# EAGLE design i2s-shifter (EAGLE 6.4)
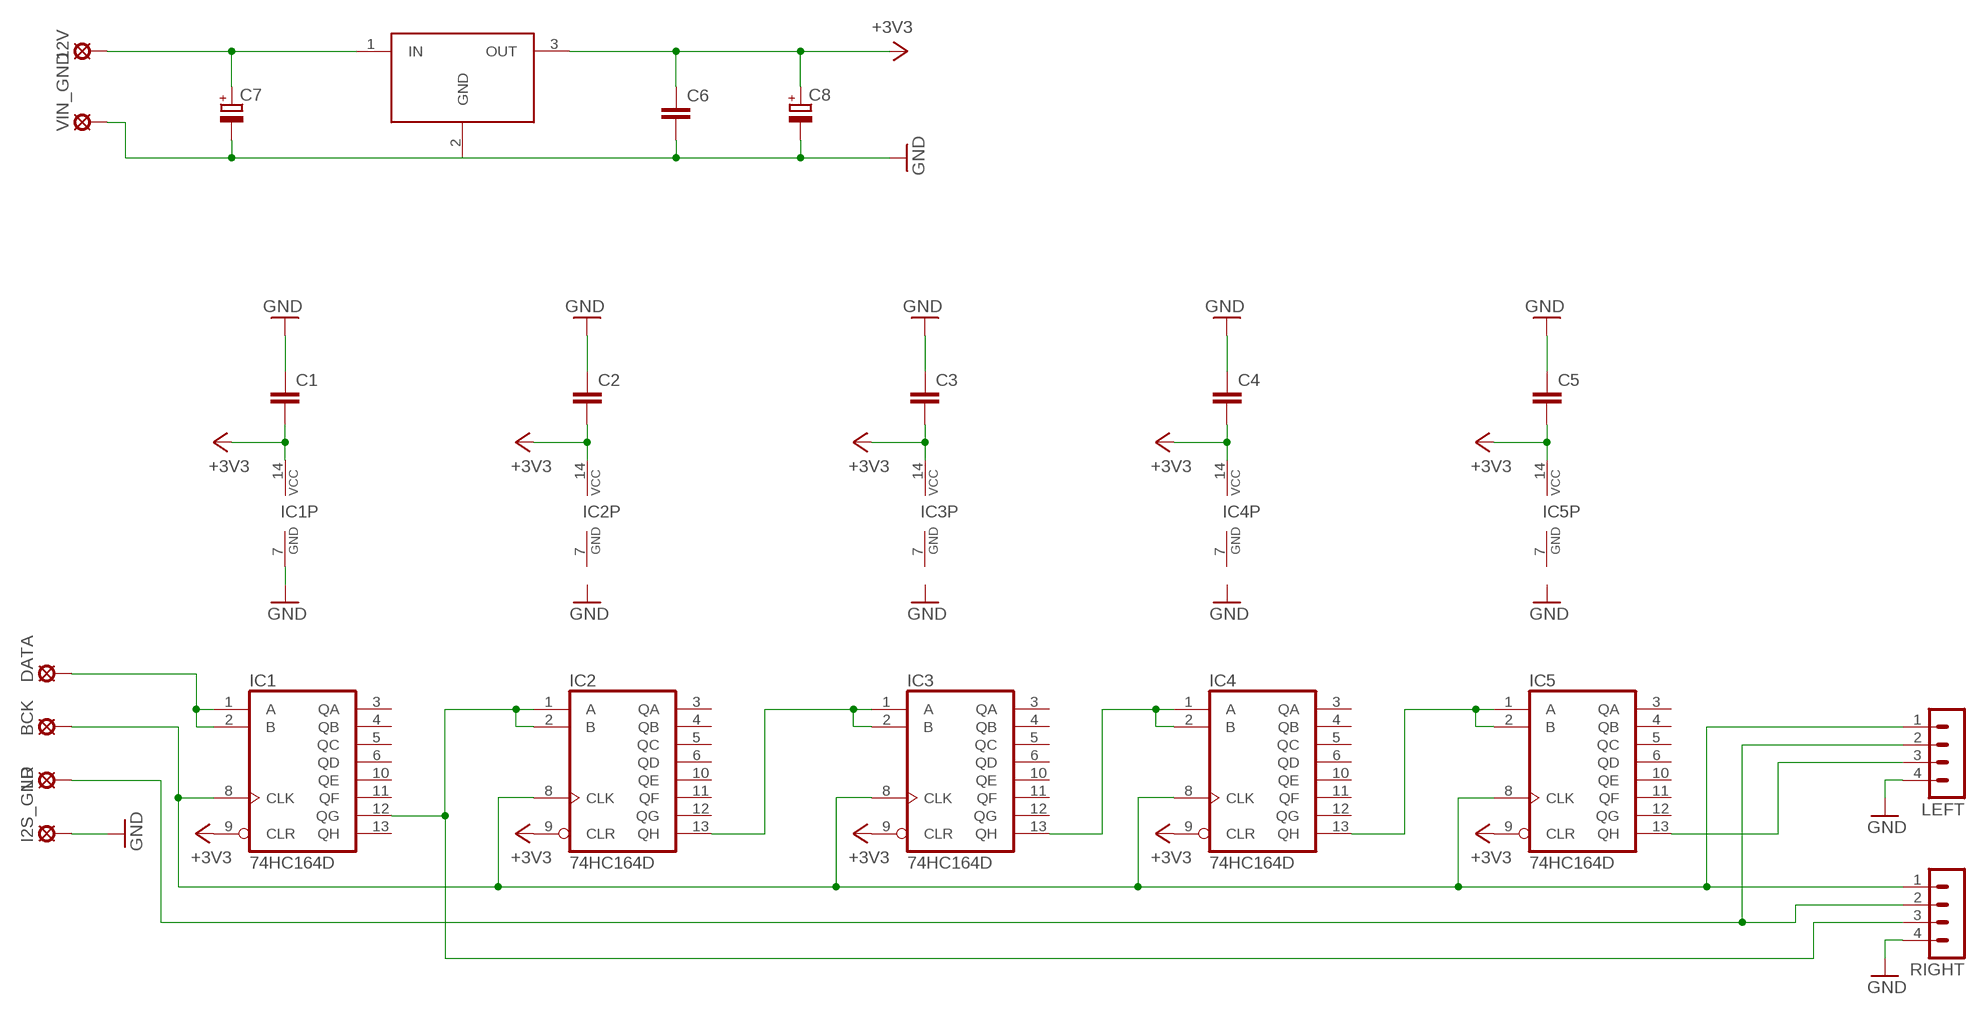
[diagram p0: schematic, sheet 1]

## Parts
12V  LSP10  [LSP10]
BCK  LSP10  [LSP10]
C1  C-EU050-025X075  [C050-025X075]
C2  C-EU050-025X075  [C050-025X075]
C3  C-EU050-025X075  [C050-025X075]
C4  C-EU050-025X075  [C050-025X075]
C5  C-EU050-025X075  [C050-025X075]
C6  C-EU050-025X075  [C050-025X075]
C7  CPOL-EUE7.5-16  [E7,5-16]
C8  CPOL-EUE5-10.5  [E5-10,5]
DATA  LSP10  [LSP10]
I2S_GND  LSP10  [LSP10]
IC1  74HC164D  [SO14]
IC2  74HC164D  [SO14]
IC3  74HC164D  [SO14]
IC4  74HC164D  [SO14]
IC5  74HC164D  [SO14]
IT1  LM3940IT-3.3  [TO220V]
LEFT  MA04-1  [MA04-1]
LR  LSP10  [LSP10]
RIGHT  MA04-1  [MA04-1]
VIN_GND  LSP10  [LSP10]

## Nets
+3V3: C1.2 C2.2 C3.2 C4.2 C5.2 C6.1 C8.+ IC1.9(CLR) IC1.14(VCC) IC2.9(CLR) IC2.14(VCC) IC3.9(CLR) IC3.14(VCC) IC4.9(CLR) IC4.14(VCC) IC5.9(CLR) IC5.14(VCC) IT1.3(OUT)
N$1: DATA.MP IC1.1(A) IC1.2(B)
N$2: BCK.MP IC1.8(CLK) IC2.8(CLK) IC3.8(CLK) IC4.8(CLK) IC5.8(CLK) LEFT.1 RIGHT.1
N$3: IC1.12(QG) IC2.1(A) IC2.2(B) RIGHT.3
N$4: IC2.13(QH) IC3.1(A) IC3.2(B)
N$5: IC3.13(QH) IC4.1(A) IC4.2(B)
N$6: IC4.13(QH) IC5.1(A) IC5.2(B)
N$7: LEFT.2 LR.MP RIGHT.2
N$8: IC5.13(QH) LEFT.3
N$10: 12V.MP C7.+ IT1.1(IN)
NS999: C1.1 C2.1 C3.1 C4.1 C5.1 C6.2 C7.- C8.- I2S_GND.MP IC1.7(GND) LEFT.4 RIGHT.4 VIN_GND.MP ; supply symbol labelled GND
Unconnected: IC1.3(QA) IC1.4(QB) IC1.5(QC) IC1.6(QD) IC1.10(QE) IC1.11(QF) IC1.13(QH) IC2.3(QA) IC2.4(QB) IC2.5(QC) IC2.6(QD) IC2.10(QE) IC2.11(QF) IC2.12(QG) IC3.3(QA) IC3.4(QB) IC3.5(QC) IC3.6(QD) IC3.10(QE) IC3.11(QF) IC3.12(QG) IC4.3(QA) IC4.4(QB) IC4.5(QC) IC4.6(QD) IC4.10(QE) IC4.11(QF) IC4.12(QG) IC5.3(QA) IC5.4(QB) IC5.5(QC) IC5.6(QD) IC5.10(QE) IC5.11(QF) IC5.12(QG)

## Power pins joined to a net without a drawn wire
NS999: IC2.7(GND) IC3.7(GND) IC4.7(GND) IC5.7(GND) IT1.2(GND)

## Library data of the parts
12V BCK DATA I2S_GND LR VIN_GND = solpad:LSP10: SOLDER PAD drill 1.0 mm, distributor Buerklin, 12H555
C1-C6 = resistor:C-EU: CAPACITOR, European symbol
C7 C8 = resistor:CPOL-EU: POLARIZED CAPACITOR, European symbol
IC1-IC5 = 74xx-eu:74*164: 8-bit parallel out SHIFT REGISTER
IT1 = LM3940:LM3940IT-3.3: 1A Low Dropout Regulator for 5V to 3.3V Conversion
LEFT RIGHT = con-lstb:MA04-1: PIN HEADER; OC_FARNELL: unknown; OC_NEWARK: unknown

## Board
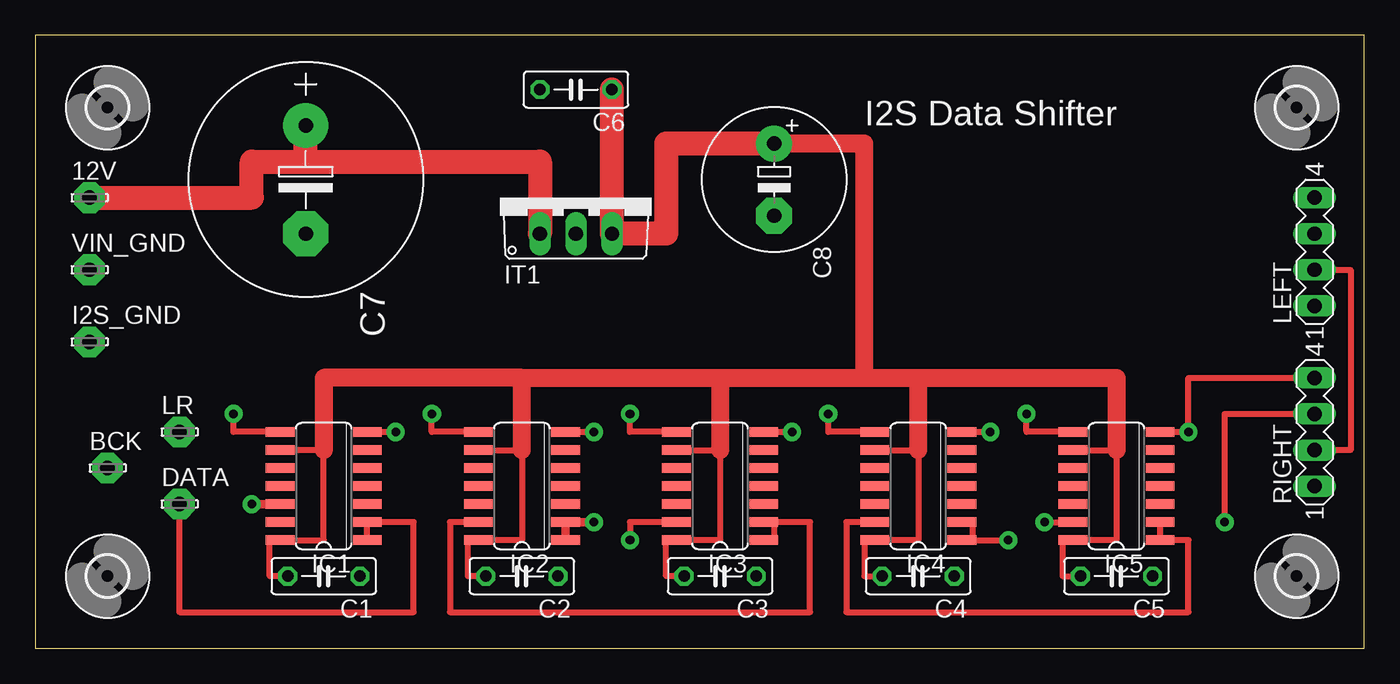
[diagram p1: board, top side]
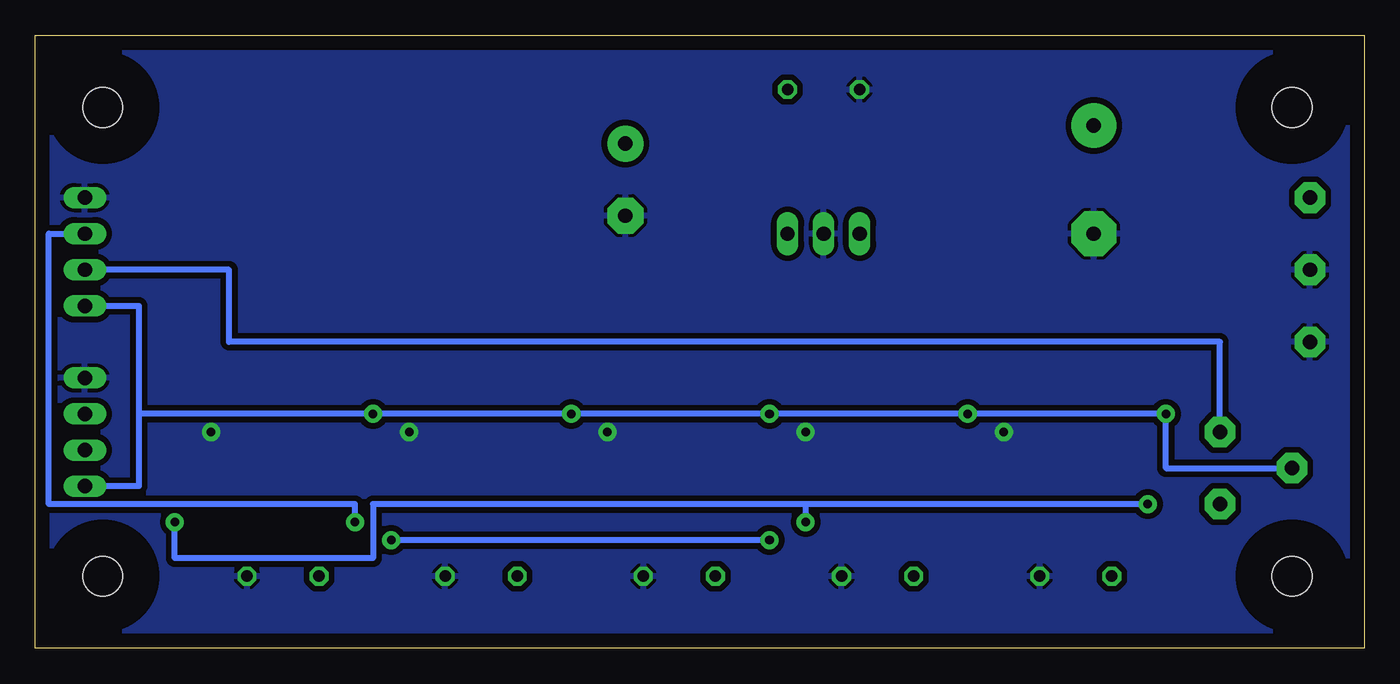
[diagram p2: board, bottom side, seen from below]

Size 93.65 x 43.18 mm. Coordinates in mm from the lower left corner, seen from the top.
Outline: 0,0 93.65,0 93.65,43.18 0,43.18 0,0
Copper layers (1*16): Top 0.035mm / dielectric 1.5mm / Bottom 0.035mm
Design rules "default": minimum track width 10mil, minimum drill 24mil, track to track 8mil, track to pad 8mil, pad to pad 8mil, via to via 8mil, smd to smd 8mil, copper to edge 40mil, drill to drill 8mil, minimum pad ring 10mil, minimum via ring 8mil, stop-mask expansion 4mil, vias tented up to drill 0mil, thermal gap 10mil

### Footprints (pad centres in the part's own frame; a part is rotated, then mirrored left to right if it is on the bottom)
LSP10 = drill 1.016 pad 2.159 octagon: MP 0,0
C050-025X075 = drill 0.813 octagon: 1 -2.54,0; 2 2.54,0
E7,5-16 = drill 1.016 pad 3.15: + -3.81,0 | drill 1.016 pad 3.15 octagon: - 3.81,0
E5-10,5 = drill 1.016 pad 2.54: + -2.54,0 | drill 1.016 pad 2.54 octagon: - 2.54,0
SO14 = smd 0.66 x 2.032: 1 -3.81,-3.073; 2 -2.54,-3.073; 3 -1.27,-3.073; 4 0,-3.073; 5 1.27,-3.073; 6 2.54,-3.073; 7 3.81,-3.073; 8 3.81,3.073; 9 2.54,3.073; 10 1.27,3.073; 11 0,3.073; 12 -1.27,3.073; 13 -2.54,3.073; 14 -3.81,3.073
TO220V = drill 1.016 long: 1 -2.54,-2.54; 2 0,-2.54; 3 2.54,-2.54
MA04-1 = drill 1.016 long: 1 -3.81,0; 2 -1.27,0; 3 1.27,0; 4 3.81,0
2,8 = hole 2.8: 0,0

### Placement (x,y rotation side)
12V  3.81,31.75 0 top
BCK  5.08,12.7 0 top
C1  20.32,5.08 180 top
C2  34.29,5.08 180 top
C3  48.26,5.08 180 top
C4  62.23,5.08 180 top
C5  76.2,5.08 180 top
C6  38.1,39.37 180 top
C7  19.05,33.02 270 top
C8  52.07,33.02 270 top
DATA  10.16,10.16 0 top
I2S_GND  3.81,21.59 0 top
IC1  20.32,11.43 90 top
IC2  34.29,11.43 90 top
IC3  48.26,11.43 90 top
IC4  62.23,11.43 90 top
IC5  76.2,11.43 90 top
IT1  38.1,31.75 0 top
LEFT  90.17,27.94 90 top
LR  10.16,15.24 0 top
RIGHT  90.17,15.24 90 top
U$1  [2,8]  88.9,38.1 0 top
U$2  [2,8]  5.08,38.1 0 top
U$3  [2,8]  5.08,38.1 0 top
U$4  [2,8]  5.08,5.08 0 top
U$5  [2,8]  88.9,38.1 0 top
U$6  [2,8]  88.9,5.08 0 top
VIN_GND  3.81,26.67 0 top

### Tracks (layer width: path | path; a pad name or v marks a point on that pad's centre or on a via)
+3V3
  Top 0.406: IC2.9 34.29,13.97 34.29,7.62 IC2.14 30.48,7.62 30.48,5.08 C2.2 | IC3.9 48.26,13.97 48.26,7.62 IC3.14 44.45,7.62 44.45,5.08 C3.2 | IC4.9 62.23,13.97 62.23,7.62 IC4.14 58.42,7.62 58.42,5.08 C4.2 | IC5.9 76.2,13.97 76.2,7.62 IC5.14 72.39,7.62 72.39,5.08 C5.2 | C1.2 16.51,5.08 16.51,7.62 IC1.14 20.32,7.62 20.32,13.97 IC1.9
  Top 1.27: 58.42,19.05 62.23,19.05 | 48.26,19.05 58.42,19.05 | 58.42,19.05 58.42,35.56 C8.+ | 34.29,19.05 20.32,19.05 20.32,13.97 | 34.29,13.97 34.29,19.05 | 34.29,19.05 48.26,19.05 | 48.26,19.05 48.26,13.97 | 62.23,13.97 62.23,19.05 | 62.23,19.05 76.2,19.05 76.2,13.97
  Top 1.676: C6.1 IT1.3 44.45,29.21 44.45,35.56 C8.+
N$1
  Top 0.406: IC1.1 IC1.2 26.67,8.89 26.67,2.54 10.16,2.54 DATA.MP
N$2  (via drill 0.6 pad 1.27)
  Top 0.406: 17.78,15.24 IC1.8 13.97,15.24 v13.97,16.51 | IC2.8 27.94,15.24 v27.94,16.51 | IC3.8 41.91,15.24 v41.91,16.51 | IC4.8 55.88,15.24 v55.88,16.51 | IC5.8 69.85,15.24 v69.85,16.51
  Bottom 0.406: RIGHT.1 86.36,11.43 86.36,16.51 | LEFT.1 86.36,24.13 86.36,16.51 | BCK.MP 13.97,12.7 v13.97,16.51 v27.94,16.51 v41.91,16.51 v55.88,16.51 v69.85,16.51 86.36,16.51
N$3  (via drill 0.6 pad 1.27)
  Top 0.406: IC2.1 36.83,7.62 | v83.82,8.89 83.82,16.51 RIGHT.3
  Top 0.61: IC1.12 v15.24,10.16 | v39.37,8.89 IC2.2 IC2.1
  Bottom 0.406: v15.24,10.16 39.37,10.16 | 39.37,10.16 v39.37,8.89 | 39.37,10.16 69.85,10.16 69.85,6.35 83.82,6.35 v83.82,8.89
N$4
  Top 0.406: IC2.13 29.21,8.89 29.21,2.54 54.61,2.54 54.61,8.89 52.07,8.89 | IC3.1 52.07,7.62 52.07,8.89 | IC3.2 52.07,8.89
N$5  (via drill 0.6 pad 1.27)
  Top 0.406: IC3.13 41.91,8.89 v41.91,7.62 | IC4.2 66.04,8.89 66.04,7.62 v68.58,7.62 IC4.1
  Bottom 0.406: v41.91,7.62 v68.58,7.62
N$6
  Top 0.406: IC4.13 57.15,8.89 57.15,2.54 81.28,2.54 81.28,7.62 IC5.1 IC5.2
N$7
  Top 0.406: LEFT.2 92.71,26.67 92.71,13.97 RIGHT.2
  Bottom 0.406: LR.MP 10.16,21.59 80.01,21.59 80.01,26.67 LEFT.2
N$8  (via drill 0.6 pad 1.27)
  Top 0.406: v71.12,8.89 IC5.13
  Bottom 0.406: LEFT.3 92.71,29.21 92.71,10.16 71.12,10.16 v71.12,8.89
N$10
  Top 1.676: 19.05,34.29 C7.+ | 19.05,34.29 35.56,34.29 IT1.1 | 12V.MP 15.24,31.75 15.24,34.29 19.05,34.29
N$12  (via drill 0.6 pad 1.27)
  other vias: 39.37,8.89
N$13  (via drill 0.6 pad 1.27)
  other vias: 71.12,8.89
NS999  (via drill 0.6 pad 1.27)
  Top 0.406: IC3.7 v53.34,15.24 | IC4.7 v67.31,15.24 | IC2.7 v39.37,15.24 | IC1.7 v25.4,15.24 | IC5.7 v81.28,15.24 81.28,19.05 RIGHT.4
  pour Bottom (isolate 0.406): 0,0 0,43.18 93.98,43.18 93.98,0

### Text on the board
tPlace: I2S Data Shifter